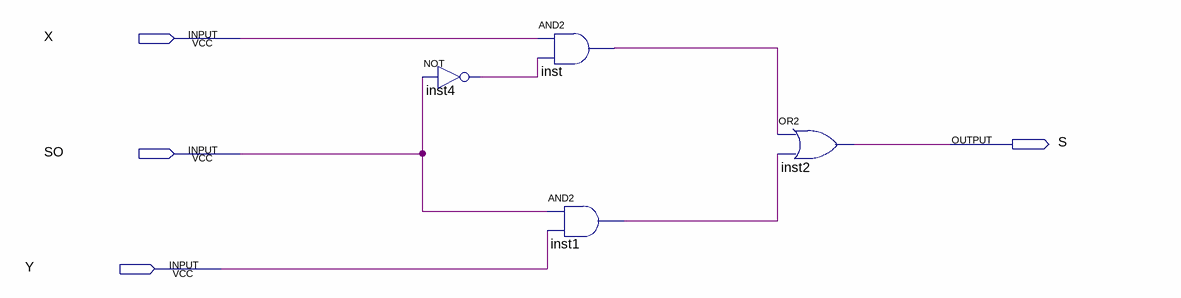
[diagram p0: schematic sheet]
// Quartus schematic Mux2.bdf as structural Verilog: 4 symbols, 4 pins
module Mux2 (
  input  X,
  input  SO,
  input  Y,
  output S
);

  wire inst1_out, inst4_out, inst_out;

  not inst4 (inst4_out, SO);
  and inst (inst_out, X, inst4_out);
  and inst1 (inst1_out, SO, Y);
  or inst2 (S, inst_out, inst1_out);
endmodule
